# EAGLE design Cookie Filter (EAGLE 6.2)
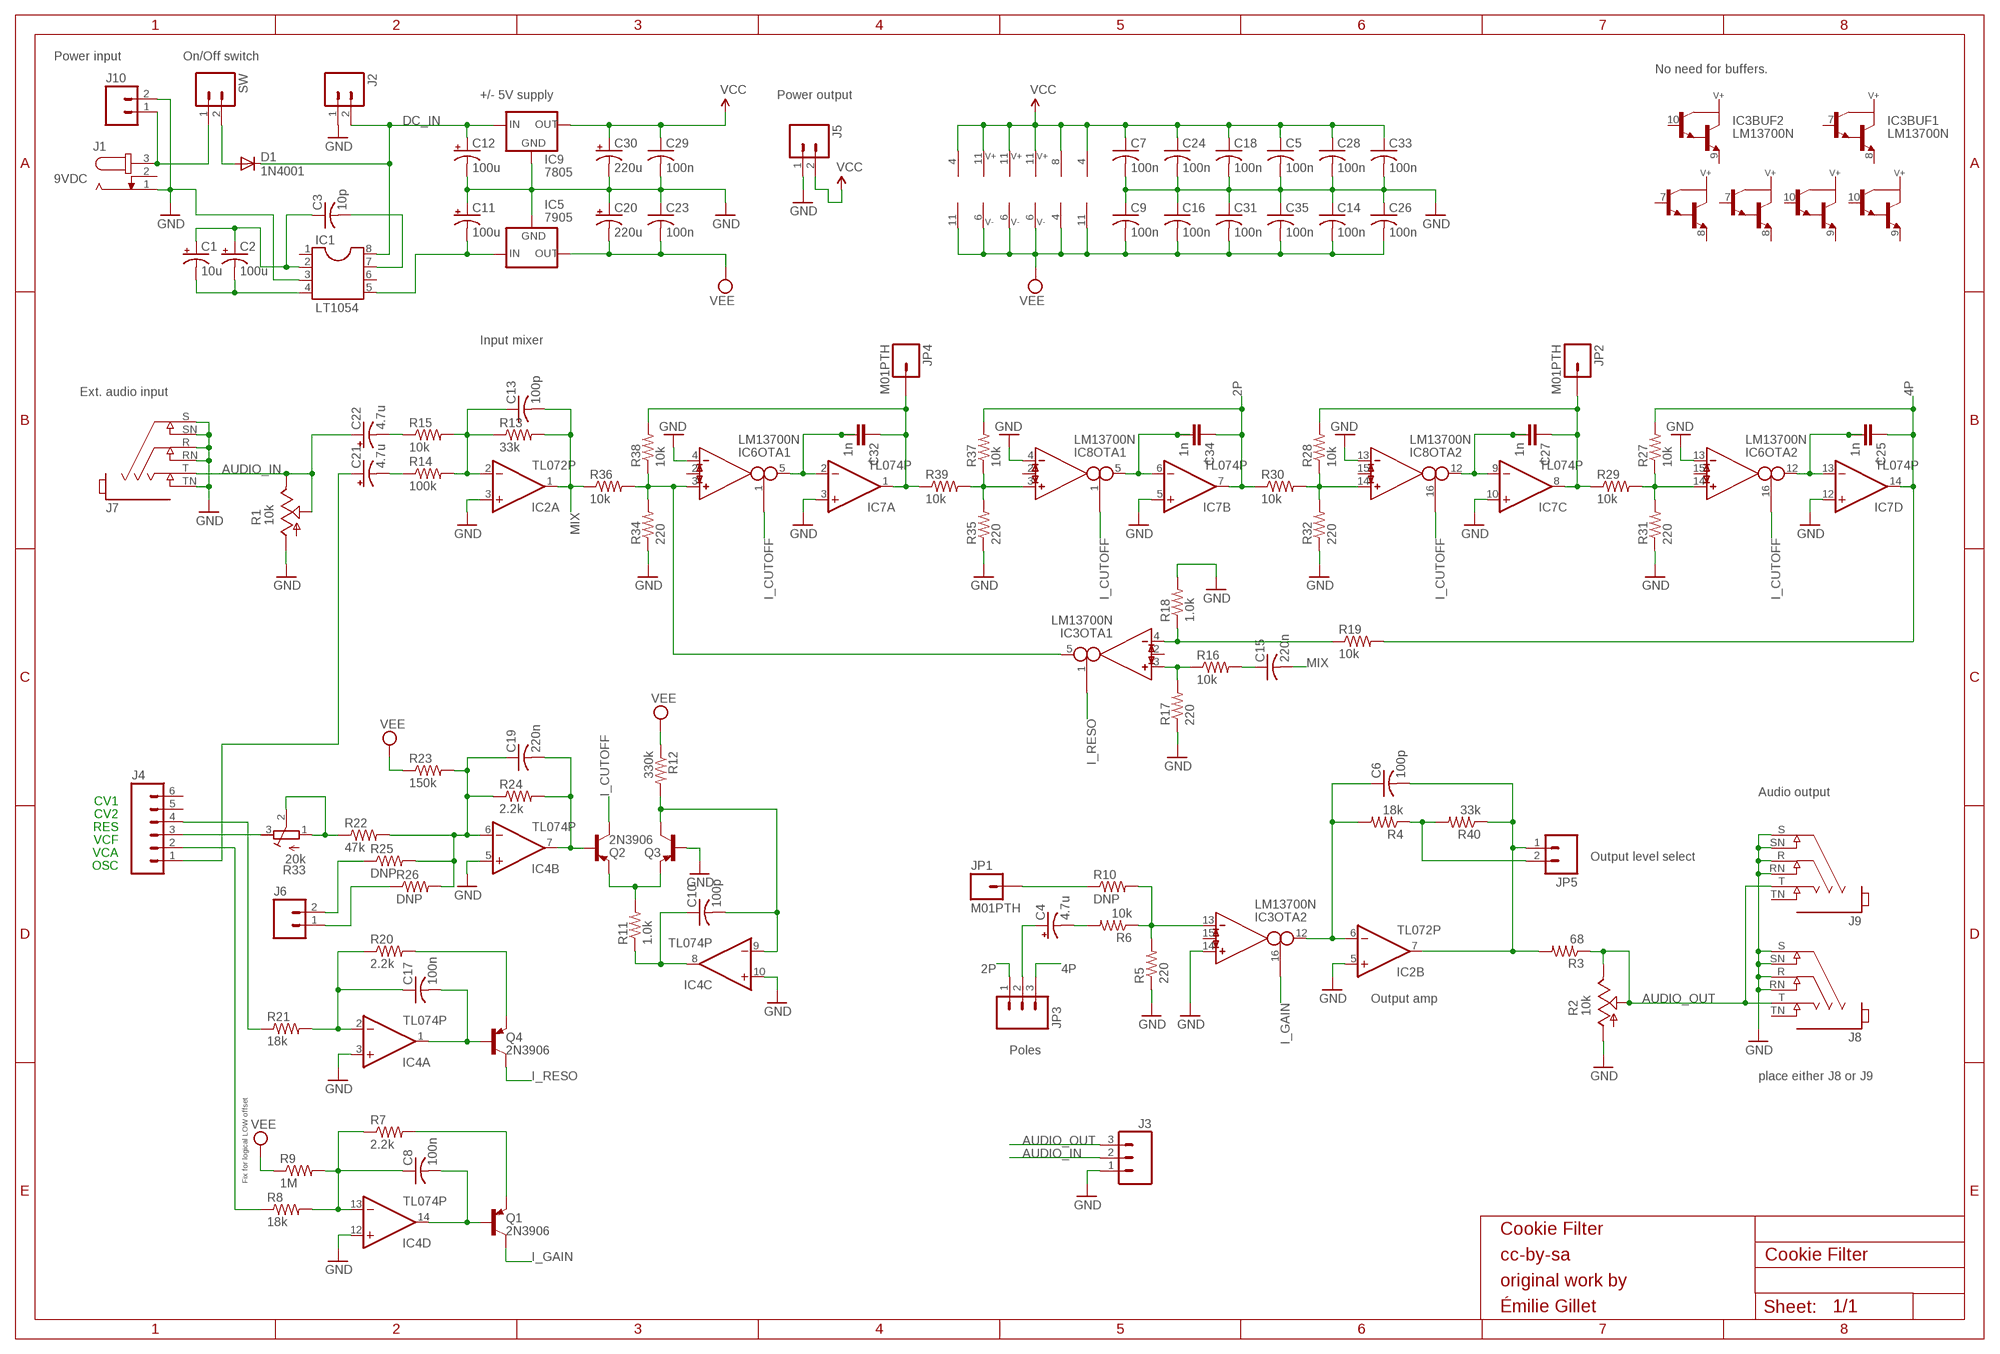
[diagram p0: schematic, sheet 1]

## Parts
C1  10u  CPOL-USE2.5-5  [E2,5-5]
C2  100u  CPOL-USE2.5-6  [E2,5-6]
C3  10p  C-US025-025X050  [C025-025X050]
C4  4.7u  CPOL-USE2.5-6  [E2,5-6]
C5  100n  C-US025-025X050  [C025-025X050]
C6  100p  C-US025-025X050  [C025-025X050]
C7  100n  C-US025-025X050  [C025-025X050]
C8  100n  C-US025-025X050  [C025-025X050]
C9  100n  C-US025-025X050  [C025-025X050]
C10  100p  C-US025-025X050  [C025-025X050]
C11  100u  CPOL-USE2.5-6  [E2,5-6]
C12  100u  CPOL-USE2.5-6  [E2,5-6]
C13  100p  C-US025-025X050  [C025-025X050]
C14  100n  C-US025-025X050  [C025-025X050]
C15  220n  C-US025-025X050  [C025-025X050]
C16  100n  C-US025-025X050  [C025-025X050]
C17  100n  C-US025-025X050  [C025-025X050]
C18  100n  C-US025-025X050  [C025-025X050]
C19  220n  C-US025-025X050  [C025-025X050]
C20  220u  CPOL-USE2.5-7  [E2,5-7]
C21  4.7u  CPOL-USE2.5-6  [E2,5-6]
C22  4.7u  CPOL-USE2.5-6  [E2,5-6]
C23  100n  C-US025-025X050  [C025-025X050]
C24  100n  C-US025-025X050  [C025-025X050]
C25  1n  C-2.5-5/2  [C2.5/5-2]
C26  100n  C-US025-025X050  [C025-025X050]
C27  1n  C-2.5-5/2  [C2.5/5-2]
C28  100n  C-US025-025X050  [C025-025X050]
C29  100n  C-US025-025X050  [C025-025X050]
C30  220u  CPOL-USE2.5-7  [E2,5-7]
C31  100n  C-US025-025X050  [C025-025X050]
C32  1n  C-2.5-5/2  [C2.5/5-2]
C33  100n  C-US025-025X050  [C025-025X050]
C34  1n  C-2.5-5/2  [C2.5/5-2]
C35  100n  C-US025-025X050  [C025-025X050]
D1  1N4001  1N4004  [DO41-10]
IC1  LT1054  DIL8  [DIL08]
IC2  TL072P  [DIL08]
IC3  LM13700N  [DIL16]
IC4  TL074P  TL084P  [DIL14]
IC5  7905  79XXS  [79XXS]
IC6  LM13700N  [DIL16]
IC7  TL074P  TL084P  [DIL14]
IC8  LM13700N  [DIL16]
IC9  7805  78XXS  [78XXS]
J1  JACK-PLUG1  [SPC4078]
J2  M02PTH  [1X02]
J3  M03PTH  [1X03]
J4  M06SIP  [1X06]
J5  M02PTH  [1X02]
J6  M02PTH  [1X02]
J7  NRJ4HF  NRJ6HF  [NRJ6HF]
J8  NRJ4HF  NRJ6HF  [NRJ6HF]
J9  NRJ4HF  NRJ6HF  [NRJ6HF]
J10  M02PTH  [1X02]
JP1  M01PTH  [1X01]
JP2  M01PTH  [1X01]
JP3  M03PTH  [1X03]
JP4  M01PTH  [1X01]
JP5  M02PTH  [1X02]
Q1  2N3906  2N3906-  [TO92-]
Q2  2N3906  2N3906-  [TO92-]
Q3  2N3906  2N3906-  [TO92-]
Q4  2N3906  2N3906-  [TO92-]
R1  10k  POT_USCABLED  [CABLE_POT_6MM]
R2  10k  POT_USCABLED  [CABLE_POT_6MM]
R3  68  R-US_0204/7  [0204/7]
R4  18k  R-US_0204/7  [0204/7]
R5  220  R-US_0204/7  [0204/7]
R6  10k  R-US_0204/7  [0204/7]
R7  2.2k  R-US_0204/7  [0204/7]
R8  18k  R-US_0204/7  [0204/7]
R9  1M  R-US_0204/7  [0204/7]
R10  DNP  R-US_0204/2V  [0204V]
R11  1.0k  R-US_0204/7  [0204/7]
R12  330k  R-US_0204/7  [0204/7]
R13  33k  R-US_0204/7  [0204/7]
R14  100k  R-US_0204/7  [0204/7]
R15  10k  R-US_0204/7  [0204/7]
R16  10k  R-US_0204/7  [0204/7]
R17  220  R-US_0204/7  [0204/7]
R18  1.0k  R-US_0204/7  [0204/7]
R19  10k  R-US_0204/7  [0204/7]
R20  2.2k  R-US_0204/7  [0204/7]
R21  18k  R-US_0204/7  [0204/7]
R22  47k  R-US_0204/7  [0204/7]
R23  150k  R-US_0204/7  [0204/7]
R24  2.2k  R-US_0204/7  [0204/7]
R25  DNP  R-US_0204/2V  [0204V]
R26  DNP  R-US_0204/2V  [0204V]
R27  10k  R-US_0204/7  [0204/7]
R28  10k  R-US_0204/7  [0204/7]
R29  10k  R-US_0204/7  [0204/7]
R30  10k  R-US_0204/7  [0204/7]
R31  220  R-US_0204/7  [0204/7]
R32  220  R-US_0204/7  [0204/7]
R33  20k  R-TRIMM3296X  [RTRIM3296X]
R34  220  R-US_0204/7  [0204/7]
R35  220  R-US_0204/7  [0204/7]
R36  10k  R-US_0204/7  [0204/7]
R37  10k  R-US_0204/7  [0204/7]
R38  10k  R-US_0204/7  [0204/7]
R39  10k  R-US_0204/7  [0204/7]
R40  33k  R-US_0204/7  [0204/7]
SW  M02PTH  [1X02]

## Nets
2P: C34.1 IC7.7(B:OUT) JP3.1 R30.1 R37.2
4P: C25.1 IC7.14(D:OUT) JP3.3 R19.2 R27.2
AUDIO_IN: C22.+ J3.2 J7.T R1.E R1.S
AUDIO_OUT: J3.3 J8.T J9.T R2.E R2.S R3.1
DC_IN: C12.+ D1.C IC1.8 IC9.IN J2.2
DC_NEG: C11.- IC1.5 IC5.IN
GND: C5.2 C7.2 C9.1 C11.+ C12.- C14.1 C16.1 C18.2 C20.+ C23.1 C24.2 C26.1 C28.2 C29.2 C30.- C31.1 C33.2 C35.1 IC1.3 IC2.3(A:+IN) IC2.5(B:+IN) IC3.14(OTA2:IN_P) IC4.3(A:+IN) IC4.5(B:+IN) IC4.10(C:+IN) IC4.12(D:+IN) IC5.GND IC6.4(OTA1:IN_N) IC6.13(OTA2:IN_N) IC7.3(A:+IN) IC7.5(B:+IN) IC7.10(C:+IN) IC7.12(D:+IN) IC8.4(OTA1:IN_N) IC8.13(OTA2:IN_N) IC9.GND J1.1 J2.1 J3.1 J5.1 J7.R J7.RN J7.S J7.SN J7.TN J8.R J8.RN J8.S J8.SN J9.R J9.RN J9.S J9.SN J10.2 Q3.2(B) R1.A R2.A R5.1 R17.1 R18.2 R31.1 R32.1 R34.1 R35.1
I_CUTOFF: IC6.1(OTA1:I_BIAS) IC6.16(OTA2:I_BIAS) IC8.1(OTA1:I_BIAS) IC8.16(OTA2:I_BIAS) Q2.1(C)
I_GAIN: IC3.16(OTA2:I_BIAS) Q1.1(C)
I_RESO: IC3.1(OTA1:I_BIAS) Q4.1(C)
MIX: C13.2 C15.2 IC2.1(A:OUT) R13.2 R36.1
N$1: JP1.1 R10.1
N$2: C19.2 IC4.7(B:OUT) Q2.2(B) R24.2
N$3: R22.1 R33.1(E) R33.2(S)
N$4: J4.3 R33.3(A)
N$5: JP5.2 R4.1 R40.2
N$6: C13.1 IC2.2(A:-IN) R13.1 R14.2 R15.2
N$7: Q2.3(E) Q3.3(E) R11.2
N$8: C4.+ JP3.2
N$9: C10.1 IC4.8(C:OUT) R11.1
N$10: C10.2 IC4.9(C:-IN) Q3.1(C) R12.2
N$11: J4.4 R21.1
N$12: IC3.5(OTA1:OUT) IC6.3(OTA1:IN_P) R34.2 R36.2 R38.1
N$13: J1.3 J10.1 SW.1
N$14: C32.1 IC7.1(A:OUT) JP4.1 R38.2 R39.1
N$16: IC8.3(OTA1:IN_P) R35.2 R37.1 R39.2
N$17: C4.- R6.2
N$18: J6.2 R25.1
N$20: IC8.14(OTA2:IN_P) R28.1 R30.2 R32.2
N$21: C15.1 R16.2
N$22: J6.1 R26.1
N$24: IC6.14(OTA2:IN_P) R27.1 R29.2 R31.2
N$26: C27.1 IC7.8(C:OUT) JP2.1 R28.2 R29.1
N$27: C32.2 C32.3 IC6.5(OTA1:OUT) IC7.2(A:-IN)
N$28: C34.2 C34.3 IC7.6(B:-IN) IC8.5(OTA1:OUT)
N$29: IC3.4(OTA1:IN_N) R18.1 R19.1
N$30: C17.2 IC4.1(A:OUT) Q4.2(B)
N$31: C8.2 IC4.14(D:OUT) Q1.2(B)
N$33: IC3.3(OTA1:IN_P) R16.1 R17.2
N$34: IC3.13(OTA2:IN_N) R5.2 R6.1 R10.2
N$35: C21.+ J4.1
N$36: C27.2 C27.3 IC7.9(C:-IN) IC8.12(OTA2:OUT)
N$37: C25.2 C25.3 IC6.12(OTA2:OUT) IC7.13(D:-IN)
N$39: C21.- R14.1
N$40: C19.1 IC4.6(B:-IN) R22.2 R23.2 R24.1 R25.2 R26.2
N$45: J4.2 R8.1
N$47: C1.+ C2.+ C3.1 IC1.2
N$48: C1.- C2.- IC1.4
N$49: C3.2 IC1.7
N$51: C8.1 IC4.13(D:-IN) R7.1 R8.2 R9.2
N$57: C17.1 IC4.2(A:-IN) R20.1 R21.2
N$59: D1.A SW.2
N$60: Q4.3(E) R20.2
N$63: C6.2 IC2.7(B:OUT) JP5.1 R3.2 R40.1
N$68: Q1.3(E) R7.2
N$70: C6.1 IC2.6(B:-IN) IC3.12(OTA2:OUT) R4.2
N$72: C22.- R15.1
VCC: C5.1 C7.1 C18.1 C24.1 C28.1 C29.1 C30.+ C33.1 IC2.8(P:V+) IC3.11(SUPPLY:V+) IC4.4(P:V+) IC6.11(SUPPLY:V+) IC7.4(P:V+) IC8.11(SUPPLY:V+) IC9.OUT J5.2
VEE: C9.2 C14.2 C16.2 C20.- C23.2 C26.2 C31.2 C35.2 IC2.4(P:V-) IC3.6(SUPPLY:V-) IC4.11(P:V-) IC5.OUT IC6.6(SUPPLY:V-) IC7.11(P:V-) IC8.6(SUPPLY:V-) R9.1 R12.1 R23.1
Unconnected: IC1.1 IC1.6 IC3.2(OTA1:I_DIODE) IC3.7(BUF1:B) IC3.8(BUF1:E) IC3.9(BUF2:E) IC3.10(BUF2:B) IC3.15(OTA2:I_DIODE) IC6.2(OTA1:I_DIODE) IC6.7(BUF1:B) IC6.8(BUF1:E) IC6.9(BUF2:E) IC6.10(BUF2:B) IC6.15(OTA2:I_DIODE) IC8.2(OTA1:I_DIODE) IC8.7(BUF1:B) IC8.8(BUF1:E) IC8.9(BUF2:E) IC8.10(BUF2:B) IC8.15(OTA2:I_DIODE) J1.2 J4.5 J4.6 J8.TN J9.TN

## Notes on the sheet
- Power input | On/Off switch
- No need for buffers.
- +/- 5V supply | Power output
- 9VDC
- Input mixer
- Ext. audio input
- CV1 | Audio output
- CV2
- RES
- VCF
- VCA
- OSC | Output level select
- Output amp
- Poles
- place either J8 or J9
- Fix for logical LOW offset
- Cookie Filter
- cc-by-sa
- original work by
- Émilie Gillet

## Library data of the parts
C1 C2 C4 C11 C12 C20-C22 C30 = rcl:CPOL-US: POLARIZED CAPACITOR, American symbol
C3 C5-C10 C13-C19 C23 C24 C26 C28 C29 C31 C33 C35 = rcl:C-US: CAPACITOR, American symbol
C25 C27 C32 C34 = capacitor-wima:C-: CAPACITOR for alternative placement naming: default grid - extended grid/package width
D1 = diode:1N4004: DIODE general purpose rectifier, 1 A
IC1 = ic-package:DIL8: Dual In Line / Socket
IC2 = linear:TL072: OP AMP
IC3 IC6 IC8 = ota:LM13700: Dual OTA with buffers
IC4 IC7 = linear:TL084: OP AMP
IC5 = v-reg:79XXS: VOLTAGE REGULATOR
IC9 = v-reg:78XXS: VOLTAGE REGULATOR
J1 = con-jack:JACK-PLUG: DC POWER JACK Power Jack, DC, Right Angle, Through Hole, Rated 5A at 16VDC, PC Terminals Distributor: Farnell (www.Farnell.de) Drawing: 84N1161.pdf / 84N1162.pdf Manufacturer: SPC Technology (www.spctechnology.com) Type: SPC4077 / SPC 4078; OC_FARNELL: unknown; OC_NEWARK: unknown
J2 J5 J6 J10 JP5 SW = SparkFun:M02: Header 2 Standard 2-pin 0.1" header. Use with straight break away headers (SKU : PRT-00116), right angle break away headers (PRT-00553), swiss pins (PRT-00743), machine pins (PRT-00117), and female headers (PRT-00115). Molex polarized connector foot print use with SKU : PRT-08233 with associated crimp pins and housings.
J3 JP3 = SparkFun:M03: Header 3 Standard 3-pin 0.1" header. Use with straight break away headers (SKU : PRT-00116), right angle break away headers (PRT-00553), swiss pins (PRT-00743), machine pins (PRT-00117), and female headers (PRT-00115). Molex polarized connector foot print use with SKU : PRT-08232 with associated crimp pins and housings.
J4 = SparkFun:M06: Header 6 Standard 6-pin 0.1" header. Use with straight break away headers (SKU : PRT-00116), right angle break away headers (PRT-00553), swiss pins (PRT-00743), machine pins (PRT-00117), and female headers (PRT-00115). Molex polarized connector foot print use with SKU : PRT-08094 with associated crimp pins and housings. NOTES ON THE VARIANTS LOCK and LOCK_LONGPADS... This footprint was designed to help hold the alignment of a through-hole component (i.e. 6-pin header) while soldering it into place. You may notice that each hole has been shifted either up or down by 0.005 of an inch from it's more standard position (which is a perfectly straight line). This slight alteration caused the pins (the squares in the middle) to touch the edges of the holes. Because they are alternating, it causes a "brace" to hold the component in place. 0.005 has proven to be the perfect amount of "off-center" position when using our standard breakaway headers. Although looks a little odd when you look at the bare footprint, once you have a header in there, the alteration is very hard to notice. Also, if you push a header all the way into place, it is covered up entirely on the bottom side. This idea of altering the position of holes to aid alignment will be further integrated into the Sparkfun Library for other footprints. It can help hold any component with 3 or more connection pins.
J7-J9 = nh-con:NRJ6HF: Neutrik NRJ6HF Created by Nils Hintze <n.hintze@elektronikpage.net>
JP1 JP2 JP4 = SparkFun:M01: Header 1 Standard 1-pin 0.1" header. Use with straight break away headers (SKU : PRT-00116), right angle break away headers (PRT-00553), swiss pins (PRT-00743), machine pins (PRT-00117), and female headers (PRT-00115).
Q1-Q4 = gm-trans:2N3906: PNP Transistor
R1 R2 = pot-alps:POT_US
R3-R32 R34-R40 = rcl:R-US_: RESISTOR, American symbol
R33 = rcl:R-TRIMM: Trimm resistor

## Board
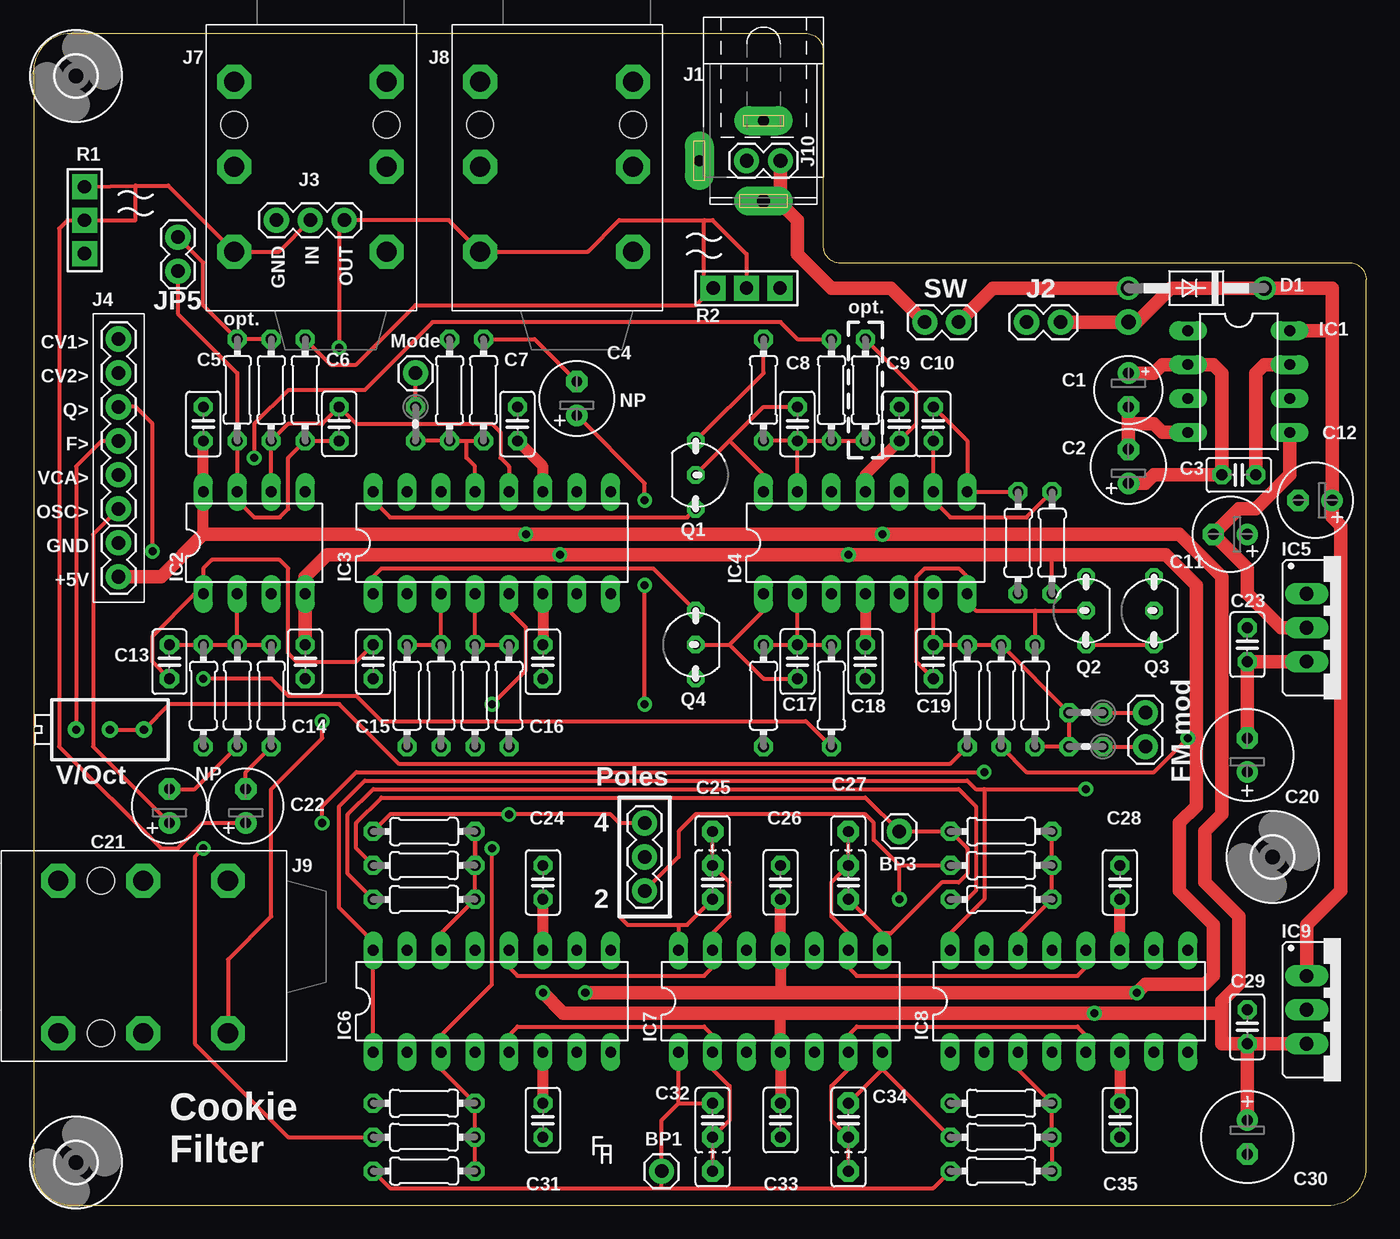
[diagram p1: board, top side]
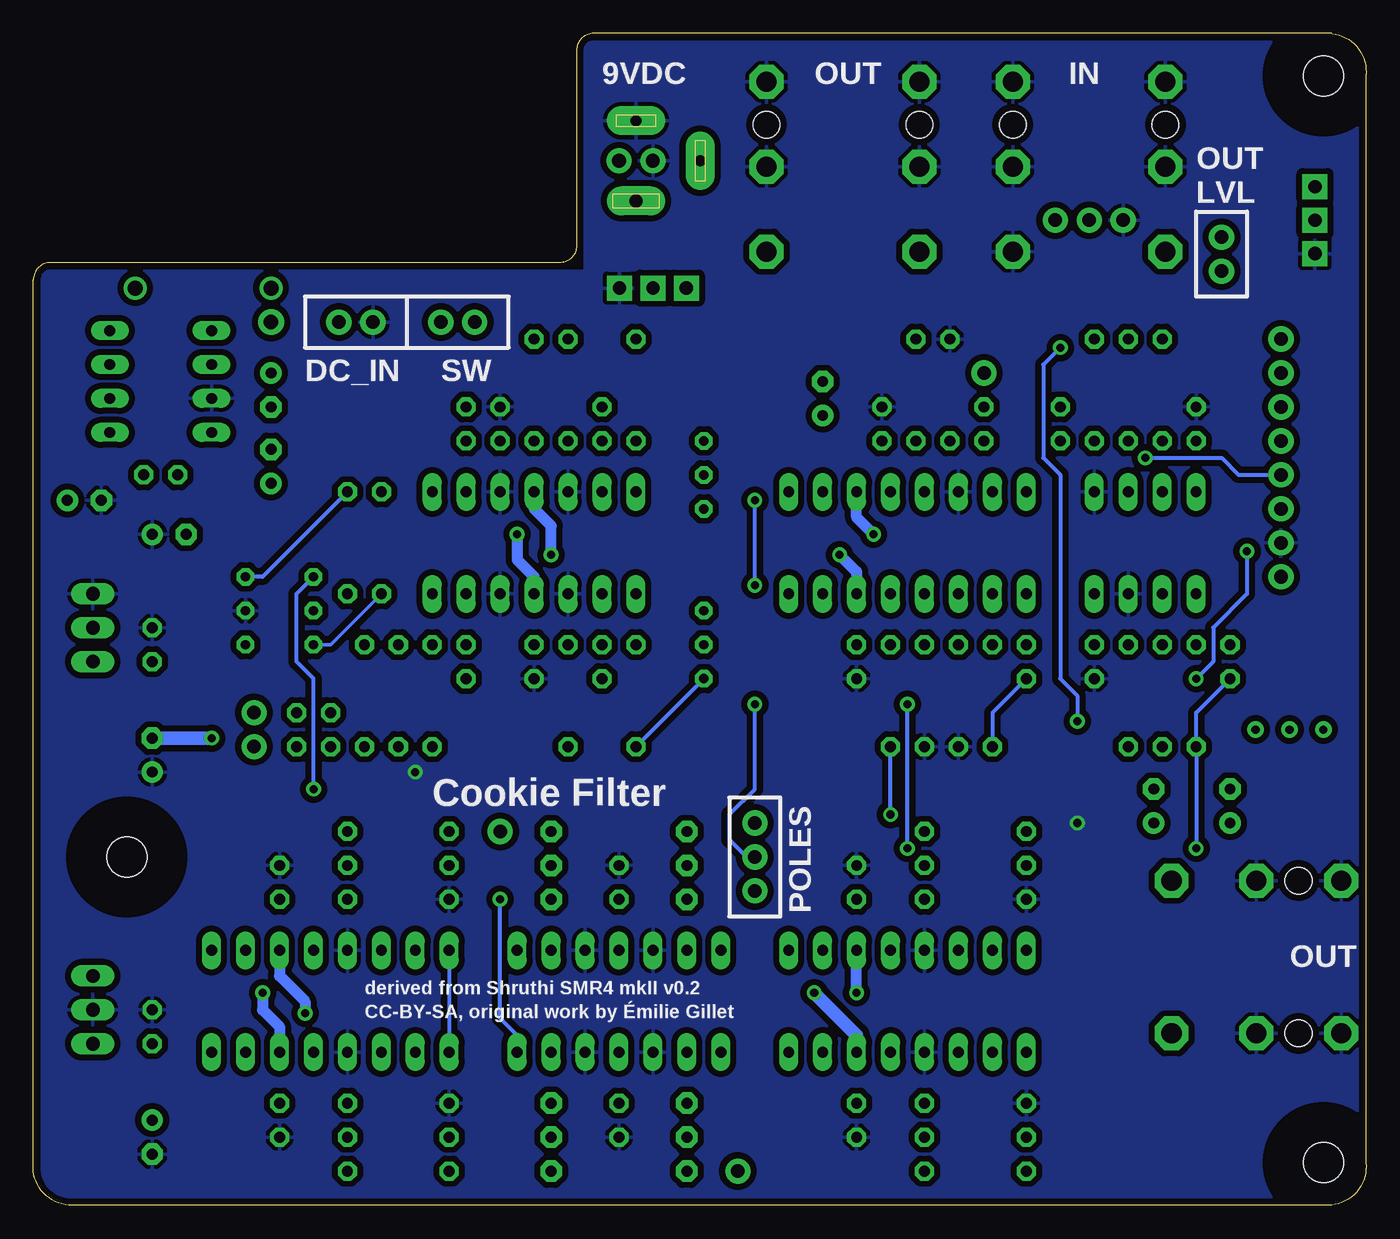
[diagram p2: board, bottom side, seen from below]

Size 99.71 x 87.65 mm. Coordinates in mm from the lower left corner, seen from the top.
Outline: 2.55,87.64 arc90 0.02,84.47 0.02,3.19 arc90 2.56,0.02 96.54,0.02 arc90 99.71,2.56 99.71,69.23 arc90 98.44,70.5 60.34,70.5 arc-90 59.07,71.77 59.07,86.38 arc90 57.8,87.65 2.56,87.65
Copper layers (1*16): Top 0.035mm / dielectric 1.5mm / Bottom 0.035mm
Design rules: minimum track width 10mil, minimum drill 20mil, track to track 10mil, track to pad 10mil, pad to pad 10mil, via to via 10mil, smd to smd 8mil, copper to edge 20mil, drill to drill 20mil, minimum pad ring 12mil, minimum via ring 10mil, stop-mask expansion 4mil, vias tented up to drill 25mil, thermal gap 12mil
tKeepout: area 59.7,71.1 to 99.7,87.6

### Footprints (pad centres in the part's own frame; a part is rotated, then mirrored left to right if it is on the bottom)
E2,5-5 = drill 0.813 pad 1.6: + -1.27,0 | drill 0.813 pad 1.6 octagon: - 1.27,0
E2,5-6 = drill 0.813 pad 1.6: + -1.27,0 | drill 0.813 pad 1.6 octagon: - 1.27,0
C025-025X050 = drill 0.813 octagon: 1 -1.27,0; 2 1.27,0
E2,5-7 = drill 0.813 pad 1.6: + -1.27,0 | drill 0.813 pad 1.6 octagon: - 1.27,0
C2.5/5-2 = drill 0.813 pad 1.6 octagon: 1 -1.27,0; 2 1.27,0; 3 3.81,0
DO41-10 = drill 1.118: A 5.08,0; C -5.08,0
DIL08 = drill 0.813 long: 1 -3.81,-3.81; 2 -1.27,-3.81; 3 1.27,-3.81; 4 3.81,-3.81; 5 3.81,3.81; 6 1.27,3.81; 7 -1.27,3.81; 8 -3.81,3.81
DIL16 = drill 0.813 long: 1 -8.89,-3.81; 2 -6.35,-3.81; 3 -3.81,-3.81; 4 -1.27,-3.81; 5 1.27,-3.81; 6 3.81,-3.81; 7 6.35,-3.81; 8 8.89,-3.81; 9 8.89,3.81; 10 6.35,3.81; 11 3.81,3.81; 12 1.27,3.81; 13 -1.27,3.81; 14 -3.81,3.81; 15 -6.35,3.81; 16 -8.89,3.81
DIL14 = drill 0.813 long: 1 -7.62,-3.81; 2 -5.08,-3.81; 3 -2.54,-3.81; 4 0,-3.81; 5 2.54,-3.81; 6 5.08,-3.81; 7 7.62,-3.81; 8 7.62,3.81; 9 5.08,3.81; 10 2.54,3.81; 11 0,3.81; 12 -2.54,3.81; 13 -5.08,3.81; 14 -7.62,3.81
79XXS = drill 1.016 long: GND -2.54,-2.54; IN 0,-2.54; OUT 2.54,-2.54
78XXS = drill 1.016 long: GND 0,-2.54; IN -2.54,-2.54; OUT 2.54,-2.54
SPC4078 = drill 0.8 pad 2.184 long: 1 -3,0; 2 0,-4.8 | drill 1 pad 2.184 long: 3 3,0
1X02 = drill 1.016 pad 1.88: 1 0,0; 2 2.54,0
1X03 = drill 1.016 pad 1.88: 1 0,0; 2 2.54,0; 3 5.08,0
1X06 = drill 1.016 pad 1.88: 1 0,0; 2 2.54,0; 3 5.08,0; 4 7.62,0; 5 10.16,0; 6 12.7,0
NRJ6HF = drill 1.5 pad 2.54 octagon: R 7.23,10.6; RN -4.2,10.6; S 7.23,4.25; SN -4.2,4.25; T 7.23,16.95; TN -4.2,16.95 | hole 2: -4.2,7.45; 7.23,7.45
1X01 = drill 1.016 pad 1.88: 1 0,0
TO92- = drill 0.7 octagon: 1 2.54,0; 2 0,0; 3 -2.54,0
CABLE_POT_6MM = drill 1 pad 1.88 square: A -2.5,0; E 2.5,0; S 0,0
0204/7 = drill 0.813 octagon: 1 -3.81,0; 2 3.81,0
0204V = drill 0.813 octagon: 1 -1.27,0; 2 1.27,0
RTRIM3296X = drill 0.61: 1 0,-2.54; 2 0,0; 3 0,2.54
3,0 = hole 3: 0,0

### Placement (x,y rotation side)
C1  81.93,60.98 270 top
C2  81.93,55.26 90 top
C3  90.19,54.63 0 top
C4  40.66,60.34 90 top
C5  12.72,58.44 90 top
C6  22.88,58.44 270 top
C7  36.21,58.44 90 top
C8  57.17,58.44 90 top
C9  64.79,58.44 270 top
C10  67.33,58.44 270 top
C11  89.55,50.18 180 top
C12  95.9,52.72 180 top
C13  10.18,40.66 270 top
C14  20.34,40.66 90 top
C15  25.42,40.66 90 top
C16  38.12,40.66 90 top
C17  57.17,40.66 270 top
C18  62.25,40.66 270 top
C19  67.33,40.66 270 top
C20  90.82,33.67 90 top
C21  10.18,29.86 90 top
C22  15.89,29.86 90 top
C23  90.82,41.93 270 top
C24  38.12,24.15 90 top
C25  50.82,24.15 90 top
C26  55.9,24.15 270 top
C27  60.98,24.15 90 top
C28  81.3,24.15 90 top
C29  90.82,13.35 90 top
C30  90.82,5.1 270 top
C31  38.12,6.37 90 top
C32  50.82,6.37 270 top
C33  55.9,6.37 270 top
C34  60.98,6.37 270 top
C35  81.3,6.37 90 top
D1  87.01,68.6 180 top
IC1  90.19,61.61 270 top
IC2  16.53,49.55 0 top
IC3  34.31,49.55 0 top
IC4  62.25,49.55 0 top
IC5  97.81,43.2 270 top
IC6  34.31,15.26 0 top
IC7  55.9,15.26 0 top
IC8  77.49,15.26 0 top
IC9  97.81,14.62 270 top
J1  54.63,78.12 270 top
J2  74.31,66.06 0 top
J3  18.18,73.68 0 top
J4  6.37,52.09 90 top
J5  6.37,49.55 270 top
J6  83.2,34.31 90 top
J7  22.24,88.28 180 top
J8  40.66,88.28 180 top
J9  -2.4,20.08 270 top
J10  55.9,78.12 180 top
JP1  28.59,62.25 0 top
JP2  64.79,27.96 0 top
JP3  45.74,23.51 90 top
JP4  47.01,2.56 0 top
JP5  10.81,69.87 90 top
Q1  49.55,54.63 270 top
Q2  78.76,44.47 90 top
Q3  83.84,44.47 90 top
Q4  49.55,41.93 90 top
R1  3.83,73.68 90 top
R2  53.36,68.6 180 top
R3  20.34,60.98 270 top
R4  17.8,60.98 270 top
R5  31.13,60.98 270 top
R6  33.67,60.98 90 top
R7  54.63,60.98 90 top
R8  59.71,60.98 270 top
R9  62.25,60.98 270 top
R10  28.59,58.44 270 top
R11  73.68,49.55 270 top
R12  76.22,49.55 90 top
R13  12.72,38.12 270 top
R14  15.26,38.12 90 top
R15  17.8,38.12 90 top
R16  27.96,38.12 270 top
R17  30.5,38.12 90 top
R18  33.04,38.12 270 top
R19  35.58,38.12 270 top
R20  54.63,38.12 270 top
R21  59.71,38.12 90 top
R22  69.87,38.12 90 top
R23  72.41,38.12 90 top
R24  74.95,38.12 90 top
R25  78.76,36.85 180 top
R26  78.76,34.31 180 top
R27  29.23,27.96 180 top
R28  72.41,27.96 180 top
R29  29.23,25.42 0 top
R30  72.41,25.42 0 top
R31  29.23,22.88 0 top
R32  72.41,22.88 0 top
R33  5.73,35.58 90 top
R34  29.23,7.64 0 top
R35  72.41,7.64 0 top
R36  29.23,5.1 0 top
R37  72.41,5.1 180 top
R38  29.23,2.56 180 top
R39  72.41,2.56 0 top
R40  15.26,60.98 90 top
SW  66.69,66.06 0 top
U$1  [3,0]  3.19,84.47 0 top
U$4  [3,0]  3.19,3.19 0 top
U$5  [3,0]  92.73,26.05 0 top

### Tracks (layer width: path | path; a pad name or v marks a point on that pad's centre or on a via)
2P  (via drill 0.6)
  Top 0.305: C34.1 63.52,10.18 | 63.52,10.18 R37.2 | 63.52,10.18 IC7.7 | v64.79,22.88 64.79,25.42 | 64.79,25.42 62.88,27.32 62.88,28.59 62.25,29.23 49.55,29.23 48.28,27.96 48.28,26.05 JP3.1 | 64.79,25.42 R30.1
  Bottom 0.305: IC7.7 63.52,12.72 64.79,13.99 v64.79,22.88
4P  (via drill 0.6)
  Top 0.305: 43.83,28.59 43.83,21.61 44.47,20.97 48.28,20.97 | 43.83,28.59 JP3.3 | 48.28,20.97 48.91,20.97 C25.1 | 48.28,20.97 IC7.14 | 43.83,28.59 43.2,29.23 v35.58,29.23 26.69,29.23 R27.2
  Bottom 0.305: v35.58,29.23 R19.2
AUDIO_IN
  Top 0.305: R1.E 7.64,76.26 | 7.64,76.26 7.64,73.68 R1.S 2.56,73.68 1.92,73.04 1.92,34.31 9.54,26.69 10.81,26.69 12.72,28.59 C22.+ | 15.01,71.18 J7.T | 7.64,76.26 10.09,76.26 J7.T | J7.T 18.37,71.33 J3.2
AUDIO_OUT  (via drill 0.6)
  Top 0.305: R2.S 53.36,71.14 50.82,73.68 50.18,73.68 | 50.18,73.68 43.83,73.68 41.49,71.33 J8.T 31.08,73.68 J3.3 22.88,73.3 v22.88,64.15 | 50.18,73.68 50.18,69.23 50.82,68.6 R2.E 49.59,67.33 28.59,67.33 24.15,62.88 22.24,62.88 R3.1 | J9.T 14.55,18.36 17.8,21.61 17.8,31.13 21.61,34.94 v21.61,36.21
  Bottom 0.305: v22.88,64.15 24.15,62.88 24.15,55.9 22.88,54.63 22.88,39.39 21.61,38.12 v21.61,36.21
DC_IN  (via drill 1.1 pad 1.93)
  Top 1.016: IC9.IN 95.27,20.97 97.81,23.51 97.81,50.82 97.17,51.45 C12.+ 97.17,65.42 | 97.17,65.42 97.17,68.6 D1.C 85.11,68.6 82.57,66.06 v81.93,66.06 J2.2 | IC1.8 97.17,65.42
DC_NEG
  Top 1.016: IC5.IN 93.36,43.2 90.82,45.74 90.82,47.64 C11.- 90.19,52.09 91.46,52.09 94,54.63 IC1.5
GND  (via drill 0.6)
  Top 0.305: v21.61,28.59 21.61,29.86 24.15,32.4 v71.14,32.4 | R31.1 23.51,24.78 23.51,29.23 25.42,31.13 69.23,31.13 70.5,29.86 70.5,23.51 69.87,22.88 R32.1
  pour Bottom (isolate 0.457): 0.65,0.65 99.08,0.65 99.08,69.87 58.44,69.87 58.44,87.01 0.65,87.01
I_CUTOFF  (via drill 0.6)
  Top 0.305: IC6.1 IC6.16 25.42,19.7 22.88,22.24 22.88,29.86 24.78,31.77 69.87,31.77 70.5,31.13 71.14,31.13 | IC8.16 68.6,20.34 71.14,22.88 71.14,31.13 | 71.14,31.13 v78.76,31.13
  Bottom 0.305: IC8.16 IC8.1 | v78.76,31.13 78.76,39.39 80.03,40.66 80.03,45.74 Q2.1
I_GAIN
  Top 0.305: IC3.16 25.42,52.72 26.69,51.45 48.91,51.45 Q1.1
I_RESO
  Top 0.305: Q4.1 46.37,47.64 26.05,47.64 25.42,47.01 IC3.1
MIX  (via drill 0.6)
  Top 0.305: C13.2 8.91,40.66 8.91,42.56 12.08,45.74 IC2.1 12.72,47.64 13.35,48.28 18.43,48.28 19.07,47.64 19.07,41.29 19.7,40.66 24.15,40.66 C15.2 | v12.72,26.69 12.08,26.05 12.08,12.08 19.07,5.1 R36.1
  Bottom 0.305: C13.2 12.72,36.85 R13.2 v12.72,26.69
N$1
  Top 0.305: R10.1 JP1.1
N$2
  Top 0.305: C19.2 66.06,40.66 66.06,47.01 66.69,47.64 69.23,47.64 69.87,47.01 IC4.7 69.87,45.1 70.5,44.47 74.95,44.47 | 74.95,44.47 Q2.2 | 74.95,44.47 R24.2
N$3
  Top 0.305: R33.2 R33.1 10.18,37.48 22.88,37.48 27.32,33.04 68.6,33.04 R22.1
N$4
  Top 0.305: J4.3 5.1,57.17 3.19,55.26 R33.3
N$5
  Top 0.305: R4.1 R40.2 12.72,67.33 12.72,70.5 JP5.2
N$6
  Top 0.305: C13.1 R13.1 R14.2 | R14.2 R15.2 | R14.2 IC2.2
N$7
  Top 0.305: Q2.3 Q3.3
  Bottom 0.254: Q2.3 77.49,41.93 R11.2
N$8  (via drill 0.6)
  Top 0.305: v45.74,52.72 45.74,53.99 C4.+ | v45.74,37.48 v45.74,46.37
  Bottom 0.305: v45.74,46.37 v45.74,52.72 | JP3.2 46.37,26.05 47.64,27.32 47.64,29.23 45.74,31.13 v45.74,37.48
N$9
  Top 0.305: R11.1 IC4.8 69.87,57.17 C10.1
N$10
  Top 0.305: C10.2 IC4.9 67.33,52.72 68.6,51.45 74.31,51.45 R12.2
  Bottom 0.305: R12.2 82.57,47.01 Q3.1
N$11  (via drill 0.6)
  Top 0.305: v8.91,48.91 8.91,58.44 7.64,59.71 J4.4 | R21.1 57.8,36.21 26.05,36.21 24.15,38.12 19.07,38.12 17.8,39.39 v12.72,39.39
  Bottom 0.305: v8.91,48.91 8.91,45.74 11.45,43.2 11.45,40.66 v12.72,39.39
N$12  (via drill 0.6)
  Top 0.305: R38.1 R36.2 R34.2 30.5,10.18 IC6.3 30.5,12.72 34.31,16.53 v34.31,26.69 | v34.31,37.48 36.85,40.02 36.85,43.2 35.58,44.47 IC3.5
  Bottom 0.305: v34.31,26.69 v34.31,37.48
N$13
  Top 1.016: SW.1 64.15,68.6 59.71,68.6 57.17,71.14 57.17,73.68 55.9,74.95 | 55.9,74.95 54.8,74.95 J1.3 | J10.1 55.9,74.95
N$14
  Top 0.305: R38.2 26.69,1.29 47.01,1.29 | 48.28,7.64 C32.1 | 48.28,7.64 IC7.1 | 47.01,1.29 JP4.1 47.01,6.37 48.28,7.64 | R39.1 67.33,1.29 47.01,1.29
N$16
  Top 0.305: IC8.3 73.68,10.18 R35.2 R37.1 R39.2
N$17
  Top 0.305: R6.2 37.48,64.79 C4.-
N$18
  Top 0.305: R25.1 J6.2
N$20
  Top 0.305: IC8.14 73.68,20.34 R32.2 R30.2 R28.1
N$21
  Bottom 0.305: C15.1 27.96,36.85 R16.2
N$22
  Top 0.305: R26.1 J6.1
N$24
  Top 0.305: R29.2 R27.1 R31.2 30.5,20.34 IC6.14
N$26
  Top 0.305: R29.1 24.15,26.69 24.15,28.59 26.05,30.5 62.25,30.5 JP2.1 R28.2 69.87,26.69 69.87,24.78 69.23,24.15 67.96,24.15 64.15,20.34 63.52,20.34 | 63.52,20.34 C27.1 | 63.52,20.34 IC7.8
N$27
  Top 0.305: C32.3 C32.2 52.09,6.37 52.09,8.91 50.82,10.18 IC7.2 50.82,12.72 50.18,13.35 36.21,13.35 35.58,12.72 IC6.5
N$28
  Top 0.305: C34.3 C34.2 59.71,6.37 59.71,8.91 60.98,10.18 IC7.6 60.98,12.72 61.61,13.35 78.12,13.35 78.76,12.72 IC8.5
N$29
  Top 0.305: IC3.4 R18.1 R19.1
N$30
  Top 0.305: IC4.1 54.63,44.47 52.09,41.93 | 52.09,41.93 54.63,39.39 C17.2 | Q4.2 52.09,41.93
N$31
  Top 0.305: IC4.14 54.63,54.63 52.09,57.17 | 52.09,57.17 54.63,59.71 C8.2 | 52.09,57.17 Q1.2
N$33
  Top 0.305: IC3.3 R17.2 R16.1
N$34
  Top 0.305: R10.2 R5.2 32.4,57.17 | 32.4,57.17 R6.1 | IC3.13 33.04,55.26 32.4,55.9 32.4,57.17
N$35
  Top 0.305: J4.1 4.46,50.18 4.46,34.31 C21.+
N$36
  Top 0.305: C27.3 C27.2 59.71,24.15 59.71,21.61 60.98,20.34 IC7.9 60.98,17.8 61.61,17.16 78.12,17.16 78.76,17.8 IC8.12
N$37
  Top 0.305: C25.3 C25.2 52.09,24.15 52.09,21.61 50.82,20.34 IC7.13 50.82,17.8 50.18,17.16 36.21,17.16 35.58,17.8 IC6.12
N$39
  Top 0.305: C21.- 12.08,31.13 R14.1
N$40
  Top 0.305: IC4.6 C19.1 R22.2 R23.2 R25.2 R26.2 R24.1
N$45  (via drill 0.6)
  Top 0.305: R8.1 57.17,64.79 55.9,66.06 29.86,66.06 24.78,60.98 19.07,60.98 16.53,58.44 v16.53,55.9
  Bottom 0.305: v16.53,55.9 10.81,55.9 9.54,54.63 J4.2
N$47
  Top 1.016: C1.+ 83.84,62.25 84.47,62.88 IC1.2 88.28,62.88 88.92,62.25 C3.1 83.84,54.63 83.2,53.99 C2.+
N$48
  Top 1.016: C1.- 81.93,58.44 | 81.93,58.44 C2.- | IC1.4 84.47,57.8 83.84,58.44 81.93,58.44
N$49
  Top 1.016: IC1.7 92.09,62.88 91.46,62.25 C3.2
N$51
  Top 0.305: IC4.13 C8.1 | C8.1 R7.1 | R9.2 R8.2 C8.1
N$57
  Top 0.305: C17.1 IC4.2 | R20.1 C17.1 | C17.1 R21.2
N$59
  Top 1.016: SW.2 71.77,68.6 D1.A
N$60
  Bottom 0.305: Q4.3 R20.2
N$63
  Top 0.305: C6.2 R3.2 19.07,55.9 19.07,52.09 18.43,51.45 16.53,51.45 15.26,52.72 IC2.7 R40.1 15.26,62.25 10.81,66.69 JP5.1
N$68
  Top 0.305: Q1.3 54.63,62.25 R7.2
N$70
  Top 0.305: 17.8,52.72 IC2.6 R4.2 19.07,58.44 21.61,58.44 C6.1 24.15,58.44 34.31,58.44 34.94,57.8 34.94,55.9 35.58,55.26 IC3.12
N$72
  Top 0.305: C22.- 15.89,32.4 R15.1
VCC  (via drill 0.6)
  Top 0.813: C5.1 IC2.8 12.72,50.18 | IC4.4 C18.1 | IC8.11 C28.1 | C33.1 IC7.4 55.9,14.37 | IC6.11 C24.1 | IC3.11 38.12,55.26 C7.1
  Top 1.016: J5.2 9.54,47.01 12.72,50.18 v36.85,50.18 v63.52,50.18 85.74,50.18 88.92,47.01 88.92,29.23 87.65,27.96 87.65,24.15 90.19,21.61 90.19,16.53 88.92,15.26 88.92,14.37 | v38.12,15.89 39.64,14.37 55.9,14.37 v79.39,14.37 88.92,14.37 | 88.92,14.37 88.92,12.08 C29.1 | C29.1 IC9.OUT | C29.1 C30.+
  Bottom 0.813: IC4.4 62.25,47.01 63.52,48.28 v63.52,50.18 | v36.85,50.18 38.12,51.45 IC3.11 | IC8.11 81.3,17.16 79.39,15.26 v79.39,14.37 | v38.12,15.89 IC6.11
VEE  (via drill 0.6)
  Top 0.305: C9.2 66.06,58.44 66.06,60.98 R9.1 | R23.1 74.31,32.4 83.84,32.4 v86.38,34.94 | R12.1 76.22,48.66
  Top 0.813: IC4.11 62.25,54.63 C9.2 | IC3.6 C16.2 | IC8.6 C35.2 | C26.2 IC7.11 55.9,15.89 | C31.2 IC6.6
  Top 1.016: C14.2 IC2.4 20.34,47.01 21.99,48.66 v39.39,48.66 v60.98,48.66 76.22,48.66 84.73,48.66 87.01,46.37 87.01,34.94 | v41.29,15.89 55.9,15.89 v82.57,15.89 83.2,16.53 87.65,16.53 88.28,17.16 88.28,20.97 85.74,23.51 85.74,28.59 87.01,29.86 87.01,34.94 | IC5.OUT C23.2 C20.- | v86.38,34.94 87.01,34.94
  Bottom 0.813: IC4.11 62.25,52.09 60.98,50.82 v60.98,48.66 | v39.39,48.66 38.12,47.39 IC3.6 | IC6.6 38.12,12.72 | v82.57,15.89 82.57,14.62 81.3,13.35 IC8.6
  Bottom 1.016: 38.12,12.72 v41.29,15.89 | C20.- v86.38,34.94

### Text on the board
tPlace: CV1> | CV2> | Q> | F> | VCA> | OSC> | GND | +5V | V/Oct | Poles | 4 | 2
tNames: GND | IN | OUT | opt. | opt. | Mode | NP | FM mod | NP | BP3 | Cookie | BP1 | Filter
bNames: IN | OUT | 9VDC | OUT | LVL | SW | DC_IN | POLES | Cookie Filter | OUT | derived from Shruthi SMR4 mkII v0.2 | CC-BY-SA, original work by Émilie Gillet